# EAGLE schematic rom_schematic (EAGLE 8.0.2)
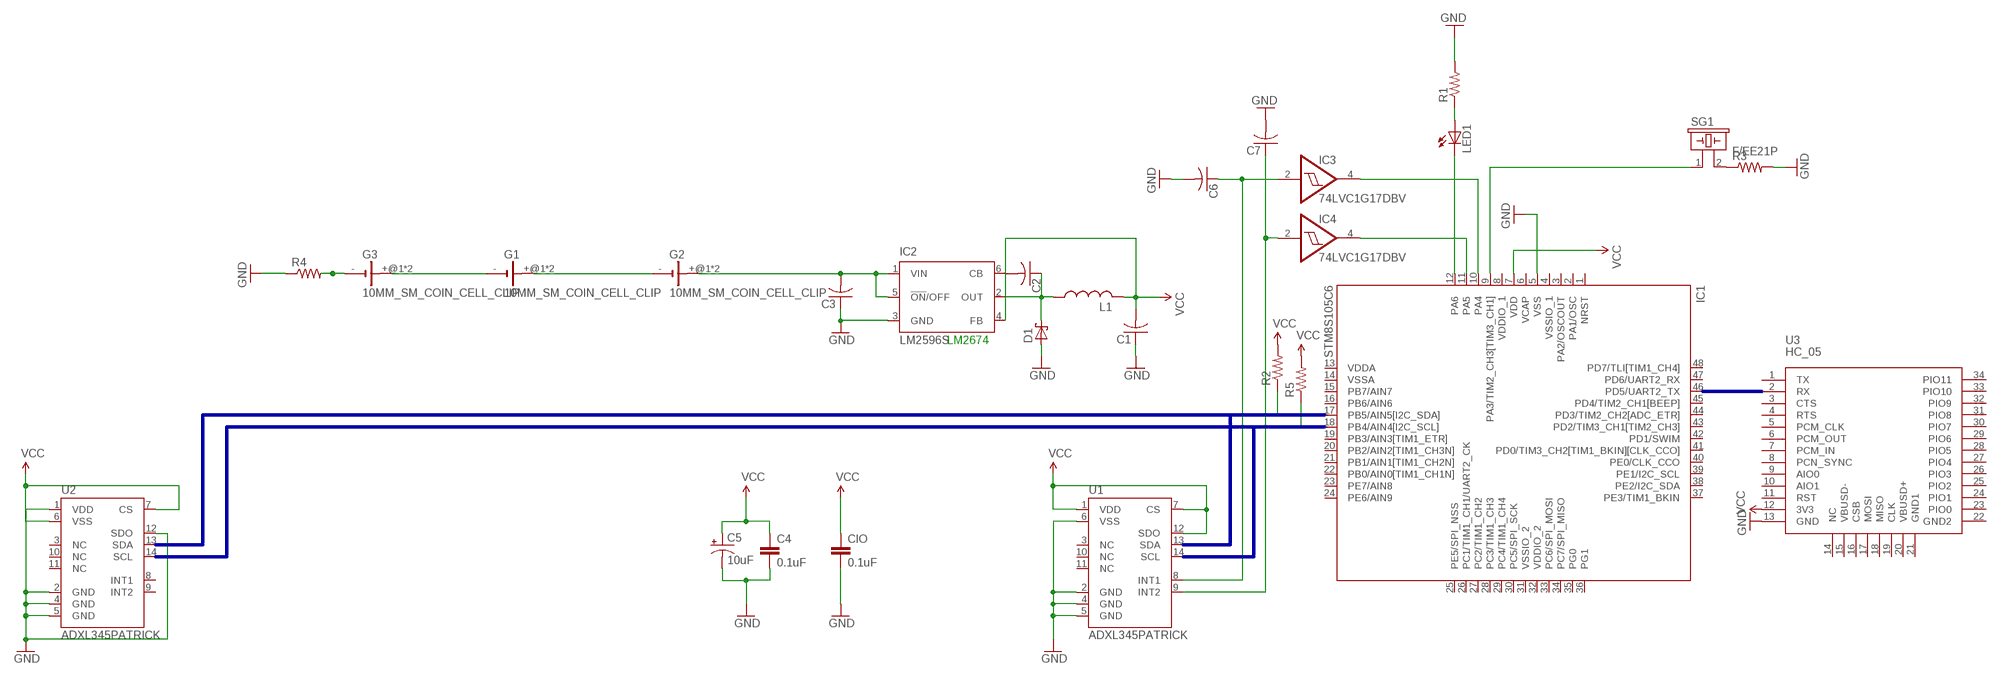
[diagram p0: schematic, sheet 1]

## Parts
C1  C-USC0805  [C0805]
C2  C-USC0805  [C0805]
C3  C-USC1210  [C1210]
C4  0.1uF  CAP0603-CAP  [0603-CAP]
C5  10uF  CAP_POL1206  [EIA3216]
C6  C-USC0805  [C0805]
C7  C-USC0805  [C0805]
CIO  0.1uF  CAP0603-CAP  [0603-CAP]
D1  SCHOTTKY-DIODEDO41  [DO41-10]
G1  10MM_SM_COIN_CELL_CLIP  [10MM_SM_COIN_CELL_CLIP]
G2  10MM_SM_COIN_CELL_CLIP  [10MM_SM_COIN_CELL_CLIP]
G3  10MM_SM_COIN_CELL_CLIP  [10MM_SM_COIN_CELL_CLIP]
IC1  STM8S105C6  [LQFP48-7X7]
IC2  LM2596S  [TO263-5]
IC3  74LVC1G17DBV  [SOT23-5]
IC4  74LVC1G17DBV  [SOT23-5]
L1  L-US0207/2V  [0207/2V]
LED1  LEDCHIPLED_0603  [CHIPLED_0603]
R1  R-US_R0805  [R0805]
R2  R-US_R0805  [R0805]
R3  R-US_R0805  [R0805]
R4  R-US_R0805  [R0805]
R5  R-US_R0805  [R0805]
SG1  F/EE21P  [F/EE21P]
U1  ADXL345PATRICK  [LGA14_1:1_PATRICK]
U2  ADXL345PATRICK  [LGA14_1:1_PATRICK]
U3  HC_05  [BLUETOOTH_SMD]

## Nets
B$1: R2.1
B$2: R5.1
GND: C1.1 C3.1 C4.2 C5.C(-) C6.2 C7.2 CIO.2 D1.A IC1.5(VSS) IC2.3(GND) R1.2 R3.2 R4.1 U1.2(GND) U1.4(GND) U1.5(GND) U1.6(VSS) U2.1(VDD) U2.2(GND) U2.4(GND) U2.5(GND) U2.12(SDO) U3.13(GND)
N$1: C7.1 IC4.2(I) U1.9(INT2)
N$3: LED1.C
N$4: LED1.A R1.1
N$5: R3.1 SG1.2
N$6: G1.+@1(+) G1.+@2(+) G2.-
N$7: C3.2 G2.+@1(+) G2.+@2(+) IC2.1(VIN) IC2.5(!ON!/OFF)
N$8: G3.- R4.2
N$9: G1.- G3.+@1(+) G3.+@2(+)
N$10: C2.1 D1.C IC2.2(OUT) L1.1
N$11: C2.2 IC2.6(CB)
N$12: IC1.9(PA3/TIM2_CH3[TIM3_CH1]) SG1.1
N$13: IC1.10(PA4) IC3.4(O)
N$14: IC1.11(PA5) IC4.4(O)
N$15: C6.1 IC3.2(I) U1.8(INT1)
VCC: C1.2 C4.1 C5.A(+) CIO.1 IC1.7(VDD) IC2.4(FB) L1.2 R2.2 R5.2 U1.1(VDD) U1.7(CS) U1.12(SDO) U2.6(VSS) U2.7(CS) U3.12(3V3)
Unconnected: IC1.1(NRST) IC1.2(PA1/OSC) IC1.3(PA2/OSCOUT) IC1.12(PA6) IC1.15(PB7/AIN7) IC1.16(PB6/AIN6) IC1.17(PB5/AIN5[I2C_SDA]) IC1.18(PB4/AIN4[I2C_SCL]) IC1.19(PB3/AIN3[TIM1_ETR]) IC1.20(PB2/AIN2[TIM1_CH3N]) IC1.21(PB1/AIN1[TIM1_CH2N]) IC1.22(PB0/AIN0[TIM1_CH1N]) IC1.23(PE7/AIN8) IC1.24(PE6/AIN9) IC1.25(PE5/SPI_NSS) IC1.26(PC1/TIM1_CH1/UART2_CK) IC1.27(PC2/TIM1_CH2) IC1.28(PC3/TIM1_CH3) IC1.29(PC4/TIM1_CH4) IC1.30(PC5/SPI_SCK) IC1.33(PC6/SPI_MOSI) IC1.34(PC7/SPI_MISO) IC1.35(PG0) IC1.36(PG1) IC1.37(PE3/TIM1_BKIN) IC1.38(PE2/I2C_SDA) IC1.39(PE1/I2C_SCL) IC1.40(PE0/CLK_CCO) IC1.41(PD0/TIM3_CH2[TIM1_BKIN][CLK_CCO]) IC1.42(PD1/SWIM) IC1.43(PD2/TIM3_CH1[TIM2_CH3]) IC1.44(PD3/TIM2_CH2[ADC_ETR]) IC1.45(PD4/TIM2_CH1[BEEP]) IC1.46(PD5/UART2_TX) IC1.47(PD6/UART2_RX) IC1.48(PD7/TLI[TIM1_CH4]) U1.3(NC) U1.10(NC) U1.11(NC) U1.13(SDA) U1.14(SCL) U2.3(NC) U2.8(INT1) U2.9(INT2) U2.10(NC) U2.11(NC) U2.13(SDA) U2.14(SCL) U3.1(TX) U3.2(RX) U3.3(CTS) U3.4(RTS) U3.5(PCM_CLK) U3.6(PCM_OUT) U3.7(PCM_IN) U3.8(PCN_SYNC) U3.9(AIO0) U3.10(AIO1) U3.11(RST) U3.14(NC) U3.15(VBUSD-) U3.16(CSB) U3.17(MOSI) U3.18(MISO) U3.19(CLK) U3.20(VBUSD+) U3.21(GND1) U3.22(GND2) U3.23(PIO0) U3.24(PIO1) U3.25(PIO2) U3.26(PIO3) U3.27(PIO4) U3.28(PIO5) U3.29(PIO6) U3.30(PIO7) U3.31(PIO8) U3.32(PIO9) U3.33(PIO10) U3.34(PIO11)

## Buses
B$1
B$2
B$3

## Notes on the sheet
- LM2674

## Power pins joined to a net without a drawn wire
GND: IC3.3(GND) IC4.3(GND)
VCAP: IC1.6(VCAP)
VCC: IC3.5(VCC) IC4.5(VCC)
VDDA: IC1.13(VDDA)
VDDIO_1: IC1.8(VDDIO_1)
VDDIO_2: IC1.32(VDDIO_2)
VSSA: IC1.14(VSSA)
VSSIO_1: IC1.4(VSSIO_1)
VSSIO_2: IC1.31(VSSIO_2)

## Library data of the parts
C1 C2 C6 C7 = rcl:C-US: CAPACITOR, American symbol
C3 = resistor:C-US: CAPACITOR, American symbol
C4 CIO = SparkFun:CAP: Capacitor Standard 0603 ceramic capacitor, and 0.1" leaded capacitor.
C5 = SparkFun:CAP_POL: Capacitor Polarized These are standard SMD and PTH capacitors. Normally 10uF, 47uF, and 100uF in electrolytic and tantalum varieties. Always verify the external diameter of the through hole cap, it varies with capacity, voltage, and manufacturer. The EIA devices should be standard.
D1 = adafruit:SCHOTTKY-DIODE: Schottky Diode
G1-G3 = battery:10MM_SM_COIN_CELL_CLIP: Battery cell clip for CR927 Source: KEYSTONE ELECTRONICS CORP. www.keyelco.com, ASTORIA, N.Y. 11105-2017 PART ANME 10mm SM COIN CELl CLIP DWG NO. 3030
IC1 = st-microelectronics:STM8S105C: Access line, 16 MHz STM8S 8-bit MCU up to 32 Kbytes Flash, integrated EEPROM,10-bit ADC, timers, UART, SPI, I²C Source: Data sheet <http://www.st.com/stonline/products/literature/ds/14771/stm8s105c4.pdf>; MPN: STM8S105C6T6; OC_FARNELL: 1706222; OC_NEWARK: 09R6033
IC2 = national-semiconductor:LM2596: SIMPLE SWITCHER® Power Converter 150 kHz 3A Step-Down Voltage Regulator Source: http://www.national.com/ds/LM/LM2596.pdf; MF: NATIONAL SEMICONDUCTOR; MPN: LM2596S-ADJ/NOPB; OC_FARNELL: 9494367; OC_NEWARK: 41K3842
IC3 IC4 = 74xx-little-de:74*1G17: Single Schmitt-Trigger Buffer
L1 = rcl:L-US: INDUCTOR, American symbol
LED1 = led:LED: LED OSRAM: - CHIPLED LG R971, LG N971, LY N971, LG Q971, LY Q971, LO R971, LY R971 LH N974, LH R974 LS Q976, LO Q976, LY Q976 LO Q996 - Hyper CHIPLED LW Q18S LB Q993, LB Q99A, LB R99A - SideLED LS A670, LO A670, LY A670, LG A670, LP A670 LB A673, LV A673, LT A673, LW A673 LH A674 LY A675 LS A676, LA A676, LO A676, LY A676, LW A676 LS A679, LY A679, LG A679 - Hyper Micro SIDELED® LS Y876, LA Y876, LO Y876, LY Y876 LT Y87S - SmartLED LW L88C, LW L88S LB L89C, LB L89S, LG L890 LS L89K, LO L89K, LY L89K LS L896, LA L896, LO L896, LY L896 - TOPLED LS T670, LO T670, LY T670, LG T670, LP T670 LSG T670, LSP T670, LSY T670, LOP T670, LYG T670 LG T671, LOG T671, LSG T671 LB T673, LV T673, LT T673, LW T673 LH T674 LS T676, LA T676, LO T676, LY T676, LB T676, LH T676, LSB T676, LW T676 LB T67C, LV T67C, LT T67C, LS T67K, LO T67K, LY T67K, LW E67C LS E67B, LA E67B, LO E67B, LY E67B, LB E67C, LV E67C, LT E67C LW T67C LS T679, LY T679, LG T679 LS T770, LO T770, LY T770, LG T770, LP T770 LB T773, LV T773, LT T773, LW T773 LH T774 LS E675, LA E675, LY E675, LS T675 LS T776, LA T776, LO T776, LY T776, LB T776 LHGB T686 LT T68C, LB T68C - Hyper Mini TOPLED® LB M676 - Mini TOPLED Santana® LG M470 LS M47K, LO M47K, LY M47K Source: http://www.osram.convergy.de LUXEON: - LUMILED® LXK2-PW12-R00, LXK2-PW12-S00, LXK2-PW14-U00, LXK2-PW14-V00 LXK2-PM12-R00, LXK2-PM12-S00, LXK2-PM14-U00 LXK2-PE12-Q00, LXK2-PE12-R00, LXK2-PE12-S00, LXK2-PE14-T00, LXK2-PE14-U00 LXK2-PB12-K00, LXK2-PB12-L00, LXK2-PB12-M00, LXK2-PB14-N00, LXK2-PB14-P00, LXK2-PB14-Q00 LXK2-PR12-L00, LXK2-PR12-M00, LXK2-PR14-Q00, LXK2-PR14-R00 LXK2-PD12-Q00, LXK2-PD12-R00, LXK2-PD12-S00 LXK2-PH12-R00, LXK2-PH12-S00 LXK2-PL12-P00, LXK2-PL12-Q00, LXK2-PL12-R00 Source: www.luxeon.com KINGBRIGHT: KA-3528ASYC Source: www.kingbright.com
R1-R5 = rcl:R-US_: RESISTOR, American symbol
SG1 = buzzer:F/EE21P: BUZZER Source: Buerklin; OC_FARNELL: unknown; OC_NEWARK: unknown
U1 U2 = Testing:ADXL345
U3 = SerialPortBluetooth:HC_05